# EAGLE design LCmeter0-LCD-6pin (EAGLE 7.2.0)
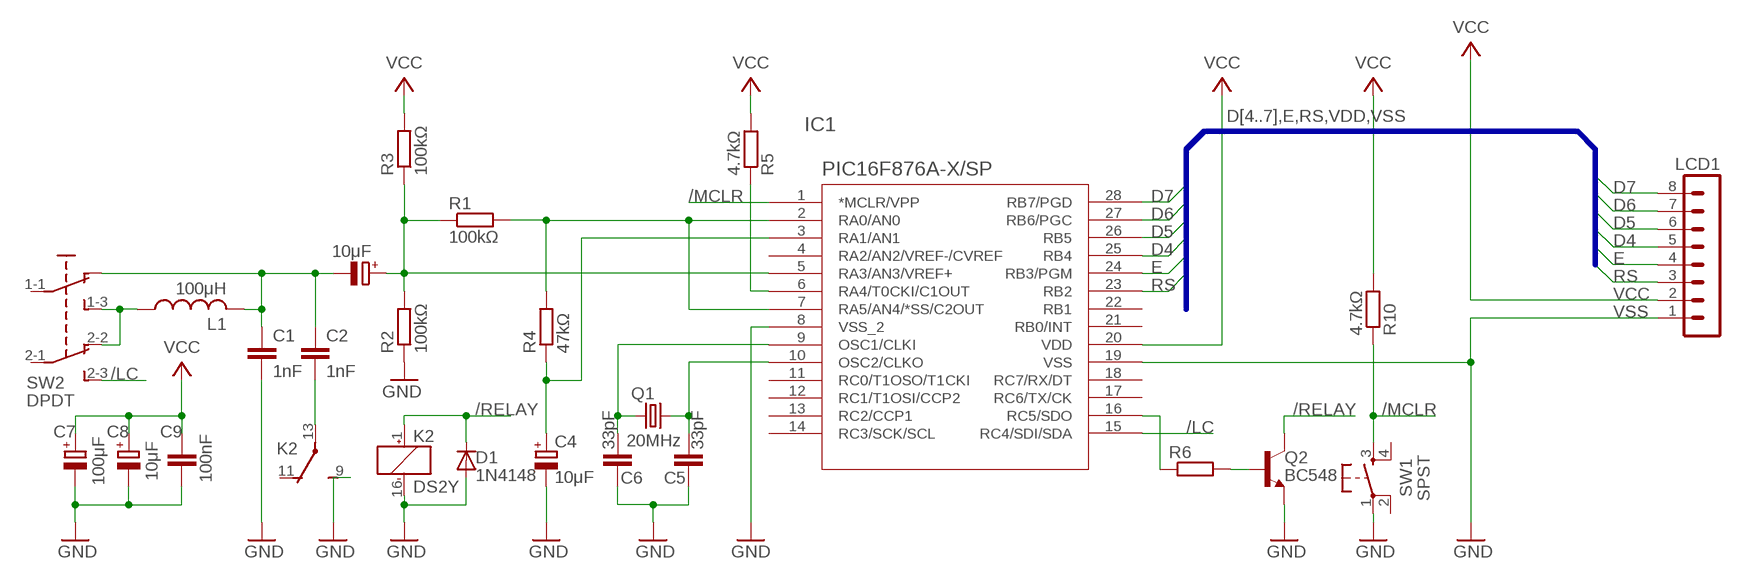
[diagram p0: schematic, sheet 1]

## Parts
C1  1nF  C-EU050-025X075  [C050-025X075]
C2  1nF  C-EU050-025X075  [C050-025X075]
C3  10μF  CPOL-EUE2.5-6  [E2,5-6]
C4  10μF  CPOL-EUE5-6  [E5-6]
C5  33pF  C-EU050-025X075  [C050-025X075]
C6  33pF  C-EU050-025X075  [C050-025X075]
C7  100μF  CPOL-EUE2.5-6  [E2,5-6]
C8  10μF  CPOL-EUE2.5-5  [E2,5-5]
C9  100nF  C-EU025-024X044  [C025-024X044]
D1  1N4148  1N4148DO35-7  [DO35-7]
IC1  PIC16F876A-X/SP  [DIL28-3]
K2  DS2Y  DS2Y-S-DC5V  [DS2Y]
L1  100μH  L-US0207/10  [0207/10]
LCD1  MA08-1  [MA08-1]
Q1  20MHz  CRYSTALHC49U70  [HC49U70]
Q2  BC548  [TO92-EBC]
R1  100kΩ  R-EU_0207/10  [0207/10]
R2  100kΩ  R-EU_0207/10  [0207/10]
R3  100kΩ  R-EU_0204/2V  [0204V]
R4  47kΩ  R-EU_0207/10  [0207/10]
R5  4.7kΩ  R-EU_0204/2V  [0204V]
R6  R-EU_0207/10  [0207/10]
R10  4.7kΩ  R-EU_0204/2V  [0204V]
SW1  SPST  PB-SPST  [PB-5]
SW2  DPDT  S-DPDT  [DPDT]

## Nets
/LC: IC1.15(RC4/SDI/SDA) SW2.2-3
/MCLR: IC1.1(*MCLR/VPP) R10.1 SW1.3(S)
/RELAY: D1.C K2.1(1:+) Q2.C
A0: IC1.2(RA0/AN0) IC1.7(RA5/AN4/*SS/C2OUT) R1.2 R4.2
A1: C4.+ IC1.3(RA1/AN1) R4.1
A3: C3.+ IC1.5(RA3/AN3/VREF+) R1.1 R2.2 R3.1
A4: IC1.6(RA4/T0CKI/C1OUT) R5.1
D4: IC1.25(RB4) LCD1.5
D5: IC1.26(RB5) LCD1.6
D6: IC1.27(RB6/PGC) LCD1.7
D7: IC1.28(RB7/PGD) LCD1.8
E: IC1.24(RB3/PGM) LCD1.4
N$1: C2.2 K2.13(3:P)
N$2: C1.1 C2.1 C3.- L1.2 SW2.1-2
N$5: Q2.B R6.2
N$7: L1.1 SW2.1-3 SW2.2-2
OSC1: C6.2 IC1.9(OSC1/CLKI) Q1.1
OSC2: C5.2 IC1.10(OSC2/CLKO) Q1.2
RC5: IC1.16(RC5/SDO) R6.1
RS: IC1.23(RB2) LCD1.3
VCC: C7.+ C8.+ C9.1 IC1.20(VDD) LCD1.2 R3.2 R5.2 R10.2
VSS: C1.2 C4.- C5.1 C6.1 C7.- C8.- C9.2 D1.A IC1.8(VSS_2) IC1.19(VSS) K2.9(3:S) K2.16(1:-) LCD1.1 Q2.E R2.1 SW1.1(P) ; supply symbol labelled GND
Unconnected: IC1.4(RA2/AN2/VREF-/CVREF) IC1.11(RC0/T1OSO/T1CKI) IC1.12(RC1/T1OSI/CCP2) IC1.13(RC2/CCP1) IC1.14(RC3/SCK/SCL) IC1.17(RC6/TX/CK) IC1.18(RC7/RX/DT) IC1.21(RB0/INT) IC1.22(RB1) K2.4(2:P) K2.6(2:O) K2.8(2:S) K2.11(3:O) SW1.2(P1) SW1.4(S1) SW2.1-1 SW2.2-1

## Buses
D[4..7],E,RS,VDD,VSS

## Library data of the parts
C1 C2 C5 C6 C9 = rcl:C-EU: CAPACITOR, European symbol
C3 C4 C7 C8 = rcl:CPOL-EU: POLARIZED CAPACITOR, European symbol
D1 = diode:1N4148: DIODE high speed (Philips)
IC1 = lc-meter:PIC16F876A-X/SP
K2 = relay:DS2Y-S-DC*: MINIATURE RELAY NAiS Source: http://www.mew-europe.com/.. en_ds_61005_0023.pdf; MPN: DS2Y-S-DC5V; OC_FARNELL: unknown; OC_NEWARK: 13P3268
L1 = rcl:L-US: INDUCTOR, American symbol
LCD1 = con-lstb:MA08-1: PIN HEADER; OC_FARNELL: unknown; OC_NEWARK: unknown
Q1 = crystal:CRYSTAL: CRYSTAL; OC_FARNELL: unknown; OC_NEWARK: unknown
Q2 = transistor-npn:BC548*: NPN Transistor
R1-R5 R10 = resistor:R-EU_: RESISTOR, European symbol
R6 = rcl:R-EU_: RESISTOR, European symbol
SW1 = lc-meter:PB-SPST
SW2 = lc-meter:S-DPDT

## Board
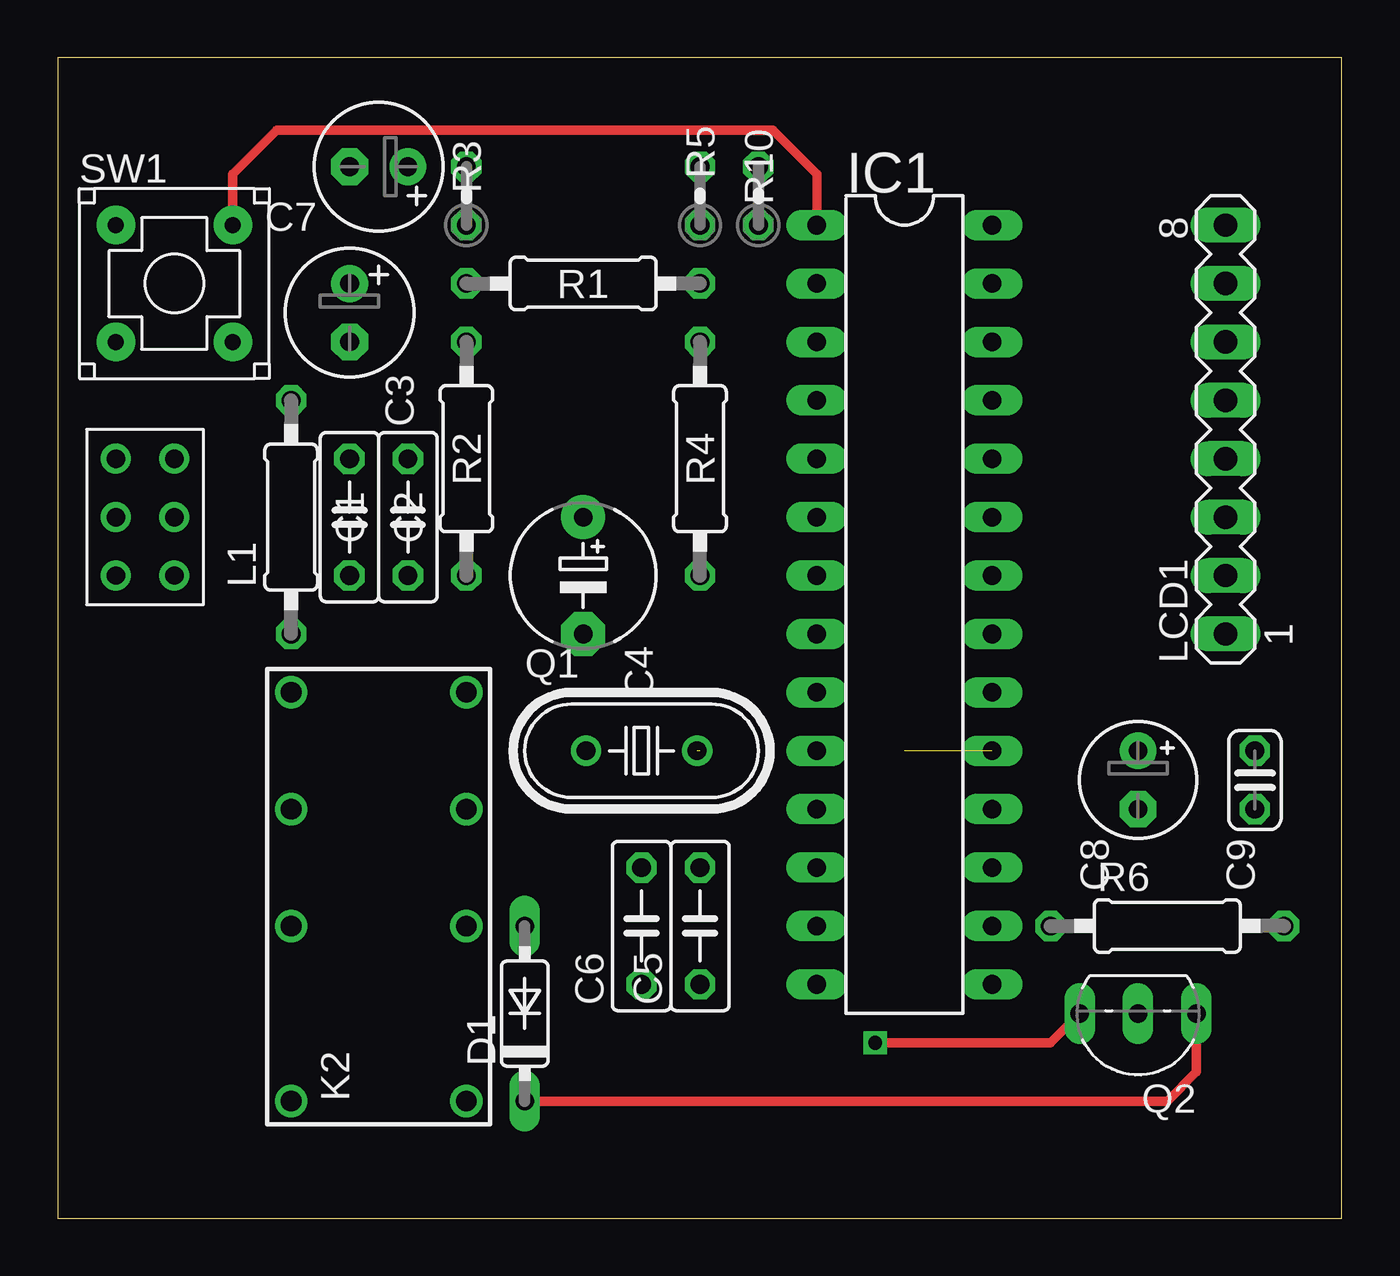
[diagram p1: board, top side]
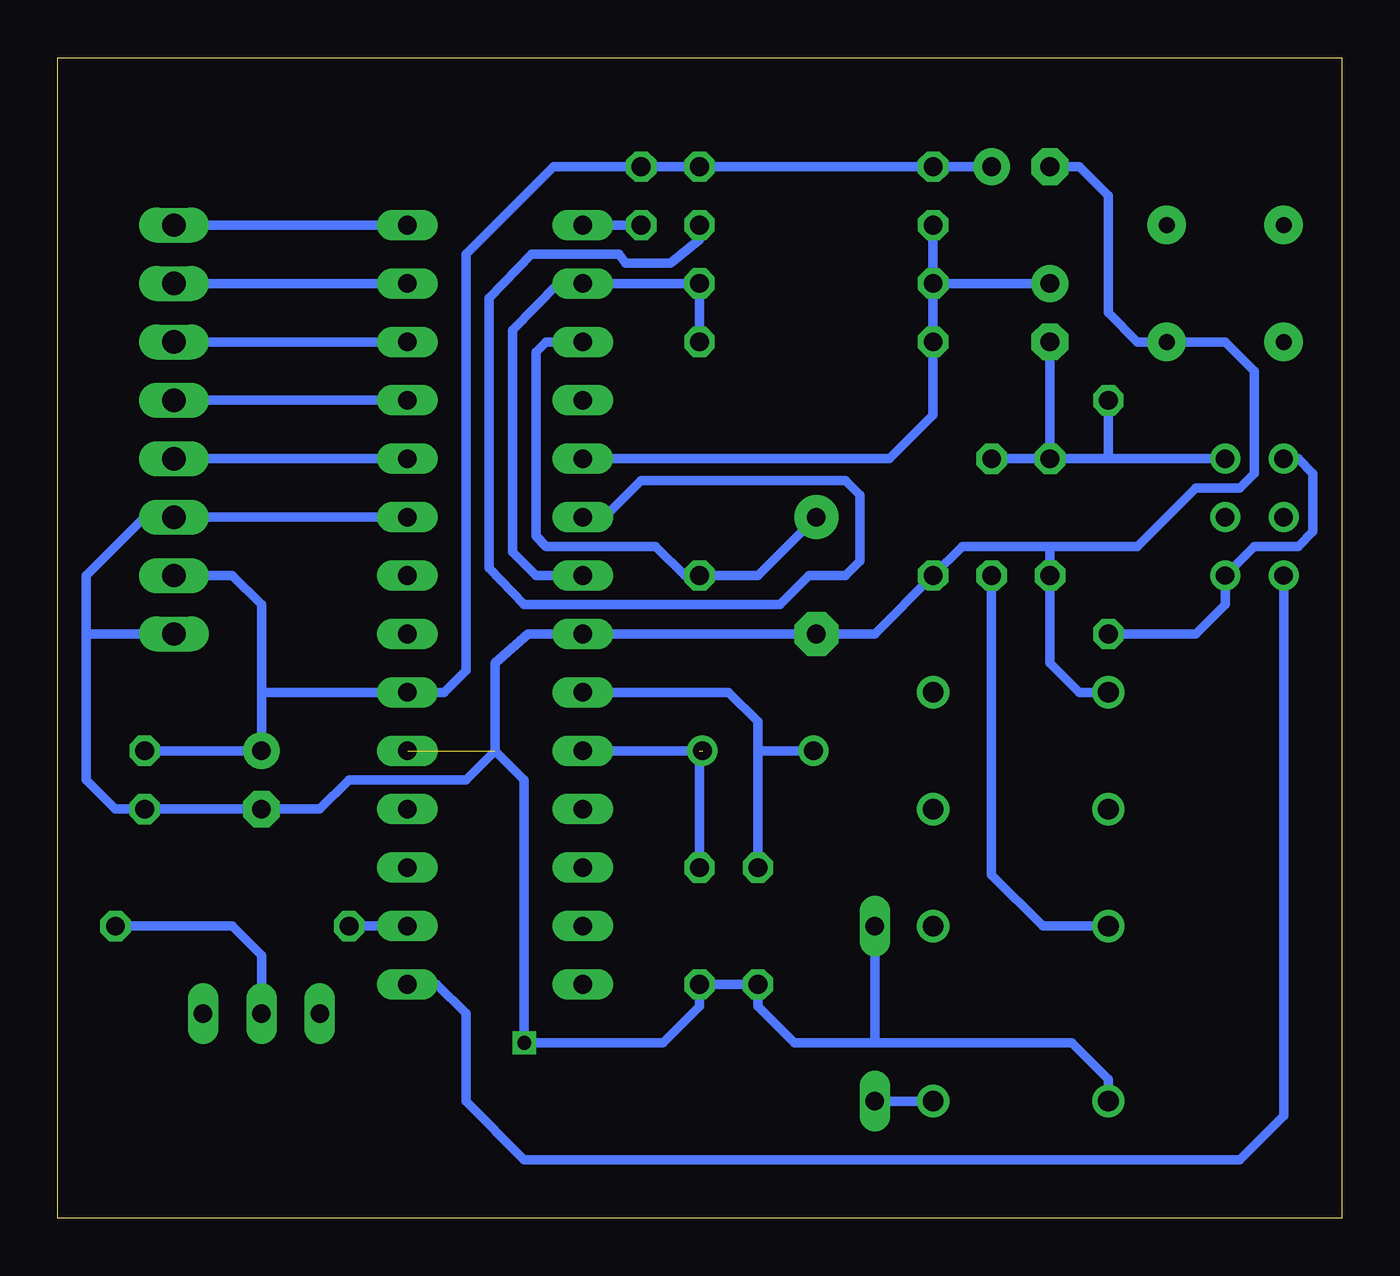
[diagram p2: board, bottom side, seen from below]

Size 55.86 x 50.47 mm. Coordinates in mm from the lower left corner, seen from the top.
Outline: 0,0 55.86,0 55.86,50.47 0,50.47 0,0
Copper layers (1*16): Top 0.035mm / dielectric 1.5mm / Bottom 0.035mm
Design rules "default": minimum track width 10mil, minimum drill 24mil, track to track 8mil, track to pad 8mil, pad to pad 8mil, via to via 8mil, smd to smd 8mil, copper to edge 40mil, drill to drill 8mil, minimum pad ring 10mil, minimum via ring 8mil, stop-mask expansion 4mil, vias tented up to drill 0mil, thermal gap 10mil

### Footprints (pad centres in the part's own frame; a part is rotated, then mirrored left to right if it is on the bottom)
C050-025X075 = drill 0.813 octagon: 1 -2.54,0; 2 2.54,0
E2,5-6 = drill 0.813 pad 1.6: + -1.27,0 | drill 0.813 pad 1.6 octagon: - 1.27,0
E5-6 = drill 0.813 pad 1.905: + -2.54,0 | drill 0.813 pad 1.905 octagon: - 2.54,0
E2,5-5 = drill 0.813 pad 1.6: + -1.27,0 | drill 0.813 pad 1.6 octagon: - 1.27,0
C025-024X044 = drill 0.813 octagon: 1 -1.27,0; 2 1.27,0
DO35-7 = drill 0.813 long: A 3.81,0; C -3.81,0
DIL28-3 = drill 0.813 long: 1 -16.51,-3.81; 2 -13.97,-3.81; 3 -11.43,-3.81; 4 -8.89,-3.81; 5 -6.35,-3.81; 6 -3.81,-3.81; 7 -1.27,-3.81; 8 1.27,-3.81; 9 3.81,-3.81; 10 6.35,-3.81; 11 8.89,-3.81; 12 11.43,-3.81; 13 13.97,-3.81; 14 16.51,-3.81; 15 16.51,3.81; 16 13.97,3.81; 17 11.43,3.81; 18 8.89,3.81; 19 6.35,3.81; 20 3.81,3.81; 21 1.27,3.81; 22 -1.27,3.81; 23 -3.81,3.81; 24 -6.35,3.81; 25 -8.89,3.81; 26 -11.43,3.81; 27 -13.97,3.81; 28 -16.51,3.81
DS2Y = drill 0.9: 1 -8.89,-3.81; 4 -1.27,-3.81; 6 3.81,-3.81; 8 8.89,-3.81; 9 8.89,3.81; 11 3.81,3.81; 13 -1.27,3.81; 16 -8.89,3.81
0207/10 = drill 0.813 octagon: 1 -5.08,0; 2 5.08,0
MA08-1 = drill 1.016 long: 1 -8.89,0; 2 -6.35,0; 3 -3.81,0; 4 -1.27,0; 5 1.27,0; 6 3.81,0; 7 6.35,0; 8 8.89,0
HC49U70 = drill 0.813: 1 -2.413,0; 2 2.413,0
TO92-EBC = drill 0.813 long: B 0,-1.27; C -2.54,-1.27; E 2.54,-1.27
0204V = drill 0.813 octagon: 1 -1.27,0; 2 1.27,0
PB-5 = drill 0.7 pad 1.676: 1 2.54,-2.54; 2 -2.54,-2.54; 3 2.54,2.54; 4 -2.54,2.54
DPDT = drill 0.8: 1-1 0,1.27; 1-2 -2.54,1.27; 1-3 2.54,1.27; 2-1 0,-1.27; 2-2 -2.54,-1.27; 2-3 2.54,-1.27

### Placement (x,y rotation side)
C1  12.7,30.48 270 top
C2  15.24,30.48 270 top
C3  12.7,39.37 270 top
C4  22.86,27.94 270 top
C5  27.94,12.7 90 top
C6  25.4,12.7 90 top
C7  13.97,45.72 180 top
C8  46.99,19.05 270 top
C9  52.07,19.05 270 top
D1  20.32,8.89 90 top
IC1  36.83,26.67 270 top
K2  13.97,13.97 90 top
L1  10.16,30.48 90 top
LCD1  50.8,34.29 90 top
Q1  25.4,20.32 0 top
Q2  46.99,7.62 180 top
R1  22.86,40.64 0 top
R2  17.78,33.02 90 top
R3  17.78,44.45 90 top
R4  27.94,33.02 90 top
R5  27.94,44.45 90 top
R6  48.26,12.7 0 top
R10  30.48,44.45 90 top
SW1  5.08,40.64 0 top
SW2  3.81,30.48 270 top

### Tracks (layer width: path | path; a pad name or v marks a point on that pad's centre or on a via)
/LC
  Bottom 0.406: SW2.2-3 2.54,4.45 4.45,2.54 35.56,2.54 38.1,5.08 38.1,8.89 39.37,10.16 IC1.15
/MCLR
  Top 0.406: IC1.1 33.02,45.4 31.11,47.31 9.53,47.31 7.62,45.4 SW1.3
  Bottom 0.406: IC1.1 R10.1
/RELAY
  Top 0.406: D1.C 48.26,5.08 49.53,6.35 Q2.C
  Bottom 0.406: D1.C K2.1
A0
  Bottom 0.406: IC1.7 35.05,27.94 36.07,28.97 36.07,38.61 34.1,40.64 IC1.2 R1.2 R4.2
A1
  Bottom 0.406: IC1.3 34.61,38.1 35.05,37.66 35.05,29.65 34.61,29.21 29.84,29.21 28.57,27.94 R4.1 25.4,27.94 C4.+
A3
  Bottom 0.406: R1.1 R3.1 | R1.1 R2.2 17.78,34.92 19.68,33.02 IC1.5 | R1.1 C3.+
A4
  Bottom 0.406: IC1.6 32.07,30.48 30.48,32.07 21.59,32.07 20.95,31.43 20.95,28.57 21.59,27.94 23.18,27.94 24.45,26.67 35.56,26.67 37.08,28.26 37.08,40.01 35.24,41.91 31.43,41.91 31.15,41.53 29.21,41.53 27.94,42.55 R5.1
D4
  Bottom 0.406: IC1.25 LCD1.5
D5
  Bottom 0.406: IC1.26 LCD1.6
D6
  Bottom 0.406: IC1.27 LCD1.7 52.07,40.64
D7
  Bottom 0.406: IC1.28 LCD1.8
E
  Bottom 0.406: LCD1.4 IC1.24
N$1
  Bottom 0.406: C2.2 15.24,14.92 13.02,12.7 K2.13
N$2
  Bottom 0.406: C3.- C1.1 | SW2.1-2 10.16,33.02 | C2.1 C1.1 | C1.1 10.16,33.02 | 10.16,33.02 L1.2
N$5
  Bottom 0.406: R6.2 48.26,12.7 46.99,11.43 Q2.B
N$7
  Bottom 0.406: SW2.2-2 1.91,33.02 1.27,32.38 1.27,29.84 1.91,29.21 3.81,29.21 SW2.1-3 5.08,26.67 6.35,25.4 L1.1
OSC1
  Bottom 0.406: IC1.9 26.67,22.86 25.4,21.59 25.4,20.32 | Q1.1 25.4,20.32 | 25.4,20.32 C6.2
OSC2  (1 unrouted)
  Bottom 0.406: IC1.10 27.94,20.32 C5.2
RC5
  Bottom 0.406: R6.1 IC1.16
RS
  Bottom 0.406: LCD1.3 IC1.23
VCC
  Bottom 0.406: C8.+ 46.99,22.86 IC1.20 39.05,22.86 38.1,23.81 38.1,41.91 34.29,45.72 R10.2 R5.2 R3.2 C7.+ | C9.1 C8.+ | LCD1.2 48.26,27.94 46.99,26.67 C8.+
VSS  (via drill 0.6)  (1 unrouted)
  Top 0.406: Q2.E 43.18,7.62 v35.56,7.62
  Bottom 0.406: 36.83,20.32 38.1,19.05 43.18,19.05 44.45,17.78 C8.- C9.2 53.34,17.78 54.61,19.05 54.61,25.4 | 36.83,20.32 35.56,19.05 v35.56,7.62 29.53,7.62 27.94,9.21 C5.1 C6.1 25.4,9.21 23.81,7.62 20.32,7.62 | 20.32,7.62 11.75,7.62 10.16,6.03 K2.16 | 36.83,20.32 36.83,24.13 35.39,25.4 IC1.8 C4.- 20.32,25.4 R2.1 16.51,29.21 12.7,29.21 | K2.9 11.43,22.86 12.7,24.13 C1.2 12.7,29.21 | 20.32,7.62 D1.A | C7.- 11.43,45.72 10.16,44.45 10.16,39.37 8.89,38.1 SW1.1 5.08,38.1 3.81,36.83 3.81,32.38 4.45,31.75 6.35,31.75 8.89,29.21 12.7,29.21 | 52.07,30.48 54.61,27.94 54.61,25.4 | 54.61,25.4 LCD1.1